# Altium project InductiveSensor_LDC1612.PrjPcb (part 2 of 2)

## Sheet CAN_TxRx.SchDoc
size A; SheetNumber: 5; SheetTotal: 7
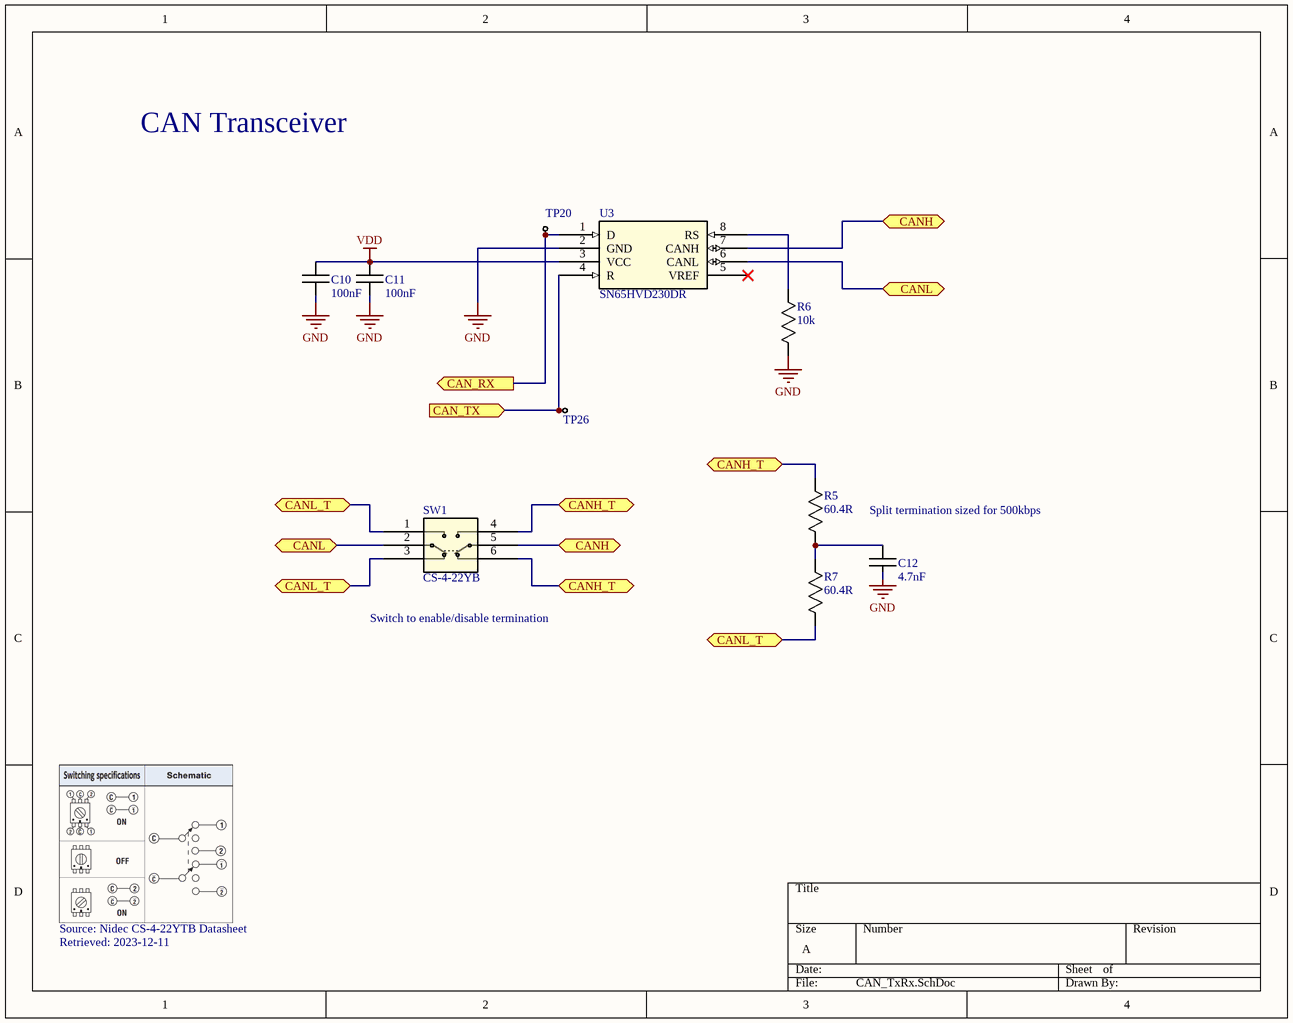
[diagram p4: CAN_TxRx.SchDoc]

### Parts
C10  100nF  [CAP0805]
C11  100nF  [CAP0805]
C12  4.7nF  [C0603]
R5  60.4R  [R0603]
R6  10k  [R0603]
R7  60.4R  [R0603]
SW1  CS-4-22YB  [CS-4-22YB_NDC]
TP20  1mm Test Point  [TP_1MM]  (value not drawn)
TP26  1mm Test Point  [TP_1MM]  (value not drawn)
U3  SN65HVD230DR  [SOIC_8]

### Ports
CAN_RX (out, see Microcontroller_STM32F04[1B]), CAN_TX (in, see Microcontroller_STM32F04[1B]), CANH (bidir, see BoardIF[2B], CAN_TxRx[2C]), CANH (bidir, see BoardIF[2B], CAN_TxRx[3A]), CANH_T (bidir, see CAN_TxRx[2B], CAN_TxRx[2C]), CANH_T (bidir, see CAN_TxRx[2B], CAN_TxRx[3B]), CANH_T (bidir, see CAN_TxRx[2C], CAN_TxRx[3B]), CANL (bidir, see BoardIF[2B], CAN_TxRx[1C]), CANL (bidir, see BoardIF[2B], CAN_TxRx[3B]), CANL_T (bidir, see CAN_TxRx[1B], CAN_TxRx[1C]), CANL_T (bidir, see CAN_TxRx[1B], CAN_TxRx[3C]), CANL_T (bidir, see CAN_TxRx[1C], CAN_TxRx[3C])

### Nets
GND: C10.2 C11.2 C12.2 R6.2 U3.2(GND)
VDD: C10.1 C11.1 U3.3(VCC)
NetC12_1: C12.1 R5.2 R7.1
NetR5_1: R5.1 SW1.4 SW1.6 ; port CANH_T
NetR6_1: R6.1 U3.8(RS)
NetR7_2: R7.2 SW1.1 SW1.3 ; port CANL_T
NetSW1_2: SW1.2 U3.6(CANL) ; port CANL
NetSW1_5: SW1.5 U3.7(CANH) ; port CANH
NetTP20_1: TP20.1 U3.1(D) ; port CAN_RX
NetTP26_1: TP26.1 U3.4(R) ; port CAN_TX

Not connected (* = marked no-connect by the designer): U3 5(VREF)*

### Notes on the sheet
- CAN Transceiver
- Split termination sized for 500kbps
- Switch to enable/disable termination
- Source: Nidec CS-4-22YTB Datasheet
- Retrieved: 2023-12-11

### Library data of the parts
C10 C11 = CC0805KRX7R9BB104: Multilayer Ceramic Capacitor, 0.1 uF, 50 V, ± 10%, X7R, 0805 [2012 Metric]; Manufacturer: Yageo; Value: 100nF 50V; Voltage: 50V; Insulation Resistance: 100GR; Supplier: Digi-Key; Supplier Part Number: 311-1140-1-ND; Manufacturer Part Number: CC0805KRX7R9BB104; RoHS: Yes; Category: Ceramic Capacitors; Stock: 6426664; Pricing: 1=0.1, 10=0.07, 50=0.0418, 100=0.0329, 500=0.02428, 1000=0.0201 (USD); Mounting Technology: Surface Mount; Case/Package: 0805; Pins: 2; Case Code (Metric): 2012; Case Code (Imperial): 0805; Material: Ceramic; Min Operating Temperature: -55°C; Max Operating Temperature: 125°C; Tolerance: 10%; Dielectric: X7R; Packaging: Tape and Reel; Voltage Rating: 50V; Package Quantity: 4000; Termination: SMD/SMT; Series: CC; Length: 2mm; Height: 0.85mm; Depth: 1.25mm; Radiation Hardening: No; RoHS Compliant: Yes; Reach SVHC Compliant: No; Lead Free: Lead Free; Halogen Free: Halogen Free; ComponentLink1URL: https://datasheet.ciiva.com/11786/0900766b80d84f1d-11786009.pdf?src-supplier=Rs; ComponentLink1Description: https://datasheet.ciiva.com/11786/0900766b80d84f1d-11786009.pdf?src-supplier=Rs; ComponentLink2URL: https://datasheet.ciiva.com/46393/1734573-46393307.pdf?src-supplier=Element14; ComponentLink2Description: https://datasheet.ciiva.com/46393/1734573-46393307.pdf?src-supplier=Element14; ComponentLink3URL: https://datasheet.ciiva.com/155/mlccorderingcode-155930.pdf?src-supplier=Digi-Key; ComponentLink3Description: https://datasheet.ciiva.com/155/mlccorderingcode-155930.pdf?src-supplier=Digi-Key; ComponentLink4URL: https://datasheet.ciiva.com/155/mlccorderingcode-155929.pdf?src-supplier=Digi-Key; ComponentLink4Description: https://datasheet.ciiva.com/155/mlccorderingcode-155929.pdf?src-supplier=Digi-Key; ComponentLink5URL: https://datasheet.ciiva.com/155/mlccorderingcode-155931.pdf?src-supplier=Digi-Key; ComponentLink5Description: https://datasheet.ciiva.com/155/mlccorderingcode-155931.pdf?src-supplier=Digi-Key; ComponentLink6URL: https://datasheet.ciiva.com/11464/upy-gphc-x7r-6-3v-to-50v-8-11464757.pdf?src-supplier=Avnet; ComponentLink6Description: https://datasheet.ciiva.com/11464/upy-gphc-x7r-6-3v-to-50v-8-11464757.pdf?src-supplier=Avnet; ComponentLink7URL: https://datasheet.ciiva.com/28450/1489800-28450805.pdf?src-supplier=Element14; ComponentLink7Description: https://datasheet.ciiva.com/28450/1489800-28450805.pdf?src-supplier=Element14; ComponentLink8URL: https://datasheet.ciiva.com/29242/445210-da-01-en-kerko-chip-0805-x7r-0-1uf-10proz-50vg-29242074.pdf?src-supplier=Conrad; ComponentLink8Description: https://datasheet.ciiva.com/29242/445210-da-01-en-kerko-chip-0805-x7r-0-1uf-10proz-50vg-29242074.pdf?src-supplier=Conrad; LCSC Part#: C49678
C12 = C0603C472K1TACAUTO: Cap Cer 0603 4.7NF 100VDC X8G; Manufacturer: KEMET; Supplier: Digi-Key; Supplier Part Number: 399-C0603C472K1TACAUTOCT-ND; Manufacturer Part Number: C0603C472K1TACAUTO; RoHS: No; Category: Ceramic Capacitors; Stock: 10636; Pricing: 1=0.42, 10=0.284, 50=0.2264, 100=0.1869, 500=0.14604, 1000=0.12414 (USD); Value: 4.7nF 100V; LCSC Part#: C3882427; Package: 0603
R5 R7 = RC0603FR-0760R4L: Res Thick Film 0603 60.4 Ohm 1% 0.1W(1/10W) ±100ppm/C Pad SMD T/R; Manufacturer: Yageo; Power Rating: 100mW; Voltage Rating: 50V; Temperature Coefficient: 100ppm/°C; Supplier: Digi-Key; Supplier Part Number: 311-60.4HRCT-ND; Manufacturer Part Number: RC0603FR-0760R4L; RoHS: Yes; Category: Chip SMD Resistors; Stock: 143040; Pricing: 1=0.1, 10=0.019, 50=0.0112, 100=0.0093, 500=0.00622, 1000=0.00532 (USD); Case/Package: 0603; Case Code (Imperial): 0603; Case Code (Metric): 1608; Min Operating Temperature: -55°C; Max Operating Temperature: 155°C; Packaging: Tape and Reel; Value: 60.4R; Tolerance: 1%; Termination: SMD/SMT; Voltage Rating (DC): 50V; Features: Moisture Resistant; Series: RC; Max Power Dissipation: 100mW; Number of Terminations: 2; Length: 1.6mm; Width: 0.8mm; Height: 0.45mm; Lead Free: Lead Free; RoHS Compliant: Yes; ComponentLink1URL: https://datasheet.ciiva.com/12558/rc0603-272842-12558933.pdf?src-supplier=Mouser; ComponentLink1Description: https://datasheet.ciiva.com/12558/rc0603-272842-12558933.pdf?src-supplier=Mouser; LCSC Part#: C245987
R6 = RC0603JR-0710KL: SMD Chip Resistor, 10 kOhm, ± 5%, 100 mW, 0603 [1608 Metric], Thick Film, General Purpose; Manufacturer: Yageo; Value: 10kR; Temperature Coefficient: 100ppm/°C; Max Power Dissipation: 100mW; Voltage Rating (AC): 50V; Supplier: Digi-Key; Supplier Part Number: 311-10KGRCT-ND; Manufacturer Part Number: RC0603JR-0710KL; RoHS: Yes; Category: Chip SMD Resistors; Stock: 3736571; Pricing: 1=0.1, 10=0.015, 50=0.0092, 100=0.0076, 500=0.00512, 1000=0.00437 (USD); Case/Package: 0603; Min Operating Temperature: -55°C; Max Operating Temperature: 155°C; Tolerance: 5%; Number of Terminations: 2; Series: RC; Reach SVHC Compliant: 4187SVHC; RoHS Compliant: Yes; ComponentLink1URL: https://datasheet.ciiva.com/2452/pyu-rc-group-51-rohs-l-10-2452848.pdf?src-supplier=Digi-Key; ComponentLink1Description: https://datasheet.ciiva.com/2452/pyu-rc-group-51-rohs-l-10-2452848.pdf?src-supplier=Digi-Key; LCSC Part#: C99198
SW1 = CS-4-22YTB: Switch Rotary ON OFF ON DPDT 2 Flush Screwdriver Gull Wing 0.1A 16VAC 16VDC 0.5VA T/R; Mfr_Name: Nidec Copal Electronics; Manufacturer: Nidec Copal; Body Material: Epoxy; Number of Positions: 2; Voltage Rating (DC): 16V; Electrical Life: 200Cycles; Washable: Yes; Copyright: Copyright (C) 2023 Ultra Librarian. All rights reserved.; Manufacturer_Part_Number: CS-4-22YB; RefDes: RefDes; Type: DEV; Supplier: Digi-Key; Supplier Part Number: 563-1040-1-ND; Manufacturer Part Number: CS-4-22YTB; RoHS: Yes; Category: DIP Switches; Stock: 6353; Pricing: 1=2.85, 10=2.683, 25=2.4392, 100=2.1139, 250=1.91648 (USD); Mounting Technology: Surface Mount; Contact Material: Copper Alloy; Contact Plating: Gold; Min Operating Temperature: -25°C; Max Operating Temperature: 70°C; Throw Configuration: DPDT; Orientation: Vertical; Packaging: Cut Tape; Termination: Gull Wing; Series: CS-4; Actuator Type: Rotary; Lead Free: Lead Free; RoHS Compliant: Yes; ComponentLink1URL: https://datasheet.ciiva.com/2864/cs-4-2864257.pdf?src-supplier=Digi-Key; ComponentLink1Description: https://datasheet.ciiva.com/2864/cs-4-2864257.pdf?src-supplier=Digi-Key; ComponentLink2URL: https://datasheet.ciiva.com/2864/cs-4-2864258.pdf?src-supplier=Digi-Key; ComponentLink2Description: https://datasheet.ciiva.com/2864/cs-4-2864258.pdf?src-supplier=Digi-Key; ComponentLink3URL: https://datasheet.ciiva.com/2864/cs-4-2864259.pdf?src-supplier=Digi-Key; ComponentLink3Description: https://datasheet.ciiva.com/2864/cs-4-2864259.pdf?src-supplier=Digi-Key; LCSC Part#: C2921707; Value: CS-4-22YTB
TP20 TP26 = TestPoint_1mm
U3 = SN65HVD230DR: EAR99 65HVD230 Cut Tape (CT) CANbus interface driver 3.3V 17mA 72.603129mg 1Mbps; Manufacturer: Texas Instruments; Min Supply Voltage: 3V; Max Supply Voltage: 3.6V; Number of Receivers: 1; Number of I/Os: 2; Slew Rate: 15V/µs; Supplier: Digi-Key; Supplier Part Number: 296-11654-6-ND; Manufacturer Part Number: SN65HVD230DR; RoHS: Yes; Category: Interface ICs; Stock: 82408; Pricing: 1=2.5, 10=2.248, 25=2.1208, 100=1.8071, 250=1.6968, 500=1.4847, 1000=1.23018 (USD); Case/Package: D; Pins: 8; Weight: 0.002561oz; Min Operating Temperature: -40°C; Max Operating Temperature: 85°C; Data Rate: 1Mbps; Packaging: Tape and Reel; Package Quantity: 1; Operating Supply Voltage: 3.3V; Number of Transceivers: 1; Number of Drivers: 1; Series: -; Supply Current: 17mA; Number of Transmit Buffers: 1; Number of Receive Buffers: 1; Termination: SMD/SMT; Length: 4.9mm; Width: 3.91mm; Height: 1.75mm; Thickness: 1.58mm; Radiation Hardening: No; Lead Free: Lead Free; RoHS Compliant: Yes; Reach SVHC Compliant: No; ComponentLink1URL: https://datasheet.ciiva.com/3303/slos346k-3303008.pdf?src-supplier=Avnet; ComponentLink1Description: https://datasheet.ciiva.com/3303/slos346k-3303008.pdf?src-supplier=Avnet; ComponentLink2URL: https://datasheet.ciiva.com/28652/1695240-28652369.pdf?src-supplier=Element14; ComponentLink2Description: https://datasheet.ciiva.com/28652/1695240-28652369.pdf?src-supplier=Element14; ComponentLink3URL: https://datasheet.ciiva.com/4781/sn65hvd230-86923-4781328.pdf?src-supplier=Mouser; ComponentLink3Description: https://datasheet.ciiva.com/4781/sn65hvd230-86923-4781328.pdf?src-supplier=Mouser; ComponentLink4URL: https://datasheet.ciiva.com/27052/1495682-27052294.pdf?src-supplier=Jameco; ComponentLink4Description: https://datasheet.ciiva.com/27052/1495682-27052294.pdf?src-supplier=Jameco; ComponentLink5URL: https://datasheet.ciiva.com/1705/sn65hvd230-1705286.pdf?src-supplier=Digi-Key; ComponentLink5Description: https://datasheet.ciiva.com/1705/sn65hvd230-1705286.pdf?src-supplier=Digi-Key; ComponentLink6URL: https://datasheet.ciiva.com/1705/sn65hvd230-1705287.pdf?src-supplier=Digi-Key; ComponentLink6Description: https://datasheet.ciiva.com/1705/sn65hvd230-1705287.pdf?src-supplier=Digi-Key; ComponentLink7URL: https://datasheet.ciiva.com/1705/sn65hvd230-1705288.pdf?src-supplier=Digi-Key; ComponentLink7Description: https://datasheet.ciiva.com/1705/sn65hvd230-1705288.pdf?src-supplier=Digi-Key; ComponentLink8URL: https://datasheet.ciiva.com/22694/1887486-22694362.pdf?src-supplier=Element14; ComponentLink8Description: https://datasheet.ciiva.com/22694/1887486-22694362.pdf?src-supplier=Element14; ComponentLink9URL: https://datasheet.ciiva.com/15150/getdatasheetpartid-393721-15150028.pdf?src-supplier=Verical; ComponentLink9Description: https://datasheet.ciiva.com/15150/getdatasheetpartid-393721-15150028.pdf?src-supplier=Verical; LCSC Part#: C12084; Value: SN65HVD230DR

## Sheet PowerReg.SchDoc
size A; SheetNumber: 6; SheetTotal: 7
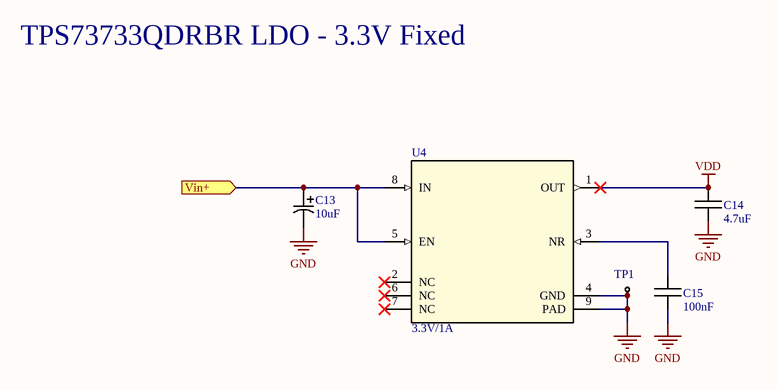
[diagram p5: PowerReg.SchDoc]

### Parts
C13  10uF  [CAP1206_TAJA]
C14  4.7uF  [CAP0805]
C15  100nF  [CAP0805]
TP1  1mm Test Point  [TP_1MM]  (value not drawn)
U4  3.3V/1A  [VSON_DRB8]

### Ports
Vin+ (in, see BoardIF[2B])

### Nets
GND: C13.2 C14.1 C15.2 TP1.1 U4.4(GND) U4.9(PAD)
VDD: C14.2 U4.1(OUT)
NetC13_1: C13.1 U4.5(EN) U4.8(IN) ; port Vin+
NetC15_1: C15.1 U4.3(NR)

Not connected (* = marked no-connect by the designer): U4 2(NC)* 6(NC)* 7(NC)*

### Notes on the sheet
- TPS73733QDRBR LDO - 3.3V Fixed

### Library data of the parts
C13 = TAJA106K016RNJ: Cap Tant Solid 10uF 16V A CASE 10%( 3.2 X 1.6 X 1.6mm) Inward L SMD 3216-18 3 Ohm 125C T/R; Mfr_Name: KYOCERA AVX; Type: DEV; Dielectric Material: Tantalum; Value: 10uF 16V 10% Tantalum; ESR (Equivalent Series Resistance): 3R; Leakage Current: 1.6uA; Dissipation Factor: 8%; Polarity: Polar; Frequency: 300MHz; Life (Hours): 2000Hour; Ripple Current: 158mA; Copyright: Copyright (C) 2023 Ultra Librarian. All rights reserved.; Manufacturer_Part_Number: TAJA106K016RNJ; RefDes: RefDes; Supplier: Digi-Key; Supplier Part Number: 478-1655-6-ND; Manufacturer: Kyocera AVX; Manufacturer Part Number: TAJA106K016RNJ; RoHS: Yes; Category: Tantalum Capacitors; Stock: 8878; Pricing: 1=0.35, 10=0.234, 50=0.1726, 100=0.1405, 500=0.1109, 1000=0.09365 (USD); Mounting Technology: Surface Mount,PCB; Case/Package: 1206; Pins: 2; Case Code (Metric): 3216; Case Code (Imperial): 1206; Min Operating Temperature: -55°C; Max Operating Temperature: 125°C; Tolerance: 10%; Packaging: Tape and Reel; Voltage Rating: 16V; Voltage Rating (DC): 16V; Features: General Purpose; Series: TAJ; Package Quantity: 1; Termination: SMD/SMT; Voltage: 16V; Construction: Flat; Voltage Rating (AC): 16V; Length: 3.2mm; Width: 1.6mm; Height: 1.6mm; Depth: 1.6mm; Height - Seated (Max): 0.071inch; Lead Pitch: 1.1mm; Size: 1.6mm; Radiation Hardening: No; Lead Free: Lead Free; RoHS Compliant: Yes; Reach SVHC Compliant: No; ComponentLink1URL: https://datasheet.ciiva.com/27051/1234933-27051768.pdf?src-supplier=Jameco; ComponentLink1Description: https://datasheet.ciiva.com/27051/1234933-27051768.pdf?src-supplier=Jameco; ComponentLink2URL: https://datasheet.ciiva.com/26341/559411-da-01-en-tacc-a-3-2-mm-x-1-6-mm-x-1-6-mm-10-uf-26341755.pdf?src-supplier=Conrad; ComponentLink2Description: https://datasheet.ciiva.com/26341/559411-da-01-en-tacc-a-3-2-mm-x-1-6-mm-x-1-6-mm-10-uf-26341755.pdf?src-supplier=Conrad; ComponentLink3URL: https://datasheet.ciiva.com/18710/taj-eng-18710622.pdf?src-supplier=Distrelec; ComponentLink3Description: https://datasheet.ciiva.com/18710/taj-eng-18710622.pdf?src-supplier=Distrelec; ComponentLink4URL: https://datasheet.ciiva.com/7730/1703059-7730712.pdf?src-supplier=Element14; ComponentLink4Description: https://datasheet.ciiva.com/7730/1703059-7730712.pdf?src-supplier=Element14; ComponentLink5URL: https://datasheet.ciiva.com/7730/1703059-7730713.pdf?src-supplier=Element14; ComponentLink5Description: https://datasheet.ciiva.com/7730/1703059-7730713.pdf?src-supplier=Element14; ComponentLink6URL: https://datasheet.ciiva.com/7730/taj-7730975.pdf?src-supplier=Element14; ComponentLink6Description: https://datasheet.ciiva.com/7730/taj-7730975.pdf?src-supplier=Element14; ComponentLink7URL: https://datasheet.ciiva.com/7730/1680476-7730714.pdf?src-supplier=Element14; ComponentLink7Description: https://datasheet.ciiva.com/7730/1680476-7730714.pdf?src-supplier=Element14; ComponentLink8URL: https://datasheet.ciiva.com/263/taj-263392.pdf?src-supplier=Digi-Key; ComponentLink8Description: https://datasheet.ciiva.com/263/taj-263392.pdf?src-supplier=Digi-Key; ComponentLink9URL: https://datasheet.ciiva.com/263/taj-263391.pdf?src-supplier=Digi-Key; ComponentLink9Description: https://datasheet.ciiva.com/263/taj-263391.pdf?src-supplier=Digi-Key; ComponentLink10URL: https://datasheet.ciiva.com/263/taj-263393.pdf?src-supplier=Digi-Key; ComponentLink10Description: https://datasheet.ciiva.com/263/taj-263393.pdf?src-supplier=Digi-Key; ComponentLink11URL: https://datasheet.ciiva.com/12882/taj-27497-12882509.pdf?src-supplier=Mouser; ComponentLink11Description: https://datasheet.ciiva.com/12882/taj-27497-12882509.pdf?src-supplier=Mouser; ComponentLink12URL: https://datasheet.ciiva.com/3004/taj-3004388.pdf?src-supplier=Avnet; ComponentLink12Description: https://datasheet.ciiva.com/3004/taj-3004388.pdf?src-supplier=Avnet; ComponentLink13URL: https://datasheet.ciiva.com/16379/taj-16379015.pdf?src-supplier=Future+Electronics; ComponentLink13Description: https://datasheet.ciiva.com/16379/taj-16379015.pdf?src-supplier=Future+Electronics; ComponentLink14URL: https://datasheet.ciiva.com/3004/taj-3004387.pdf?src-supplier=Avnet; ComponentLink14Description: https://datasheet.ciiva.com/3004/taj-3004387.pdf?src-supplier=Avnet; LCSC Part#: C7171
C14 = CL21A475KAQNNNE: Multilayer Ceramic Capacitor, 4.7 uF, 25 V, ± 10%, X5R, 0805 [2012 Metric]; Manufacturer: Samsung; Value: 4.7uF 25V; Voltage Rating: 25V; Supplier: Digi-Key; Supplier Part Number: 1276-1244-1-ND; Manufacturer Part Number: CL21A475KAQNNNE; RoHS: Yes; Category: Ceramic Capacitors; Stock: 3502142; Pricing: 1=0.1, 10=0.069, 50=0.0414, 100=0.0326, 500=0.02408, 1000=0.01994 (USD); Mounting Technology: Surface Mount; Case/Package: 0805; Case Code (Metric): 2012; Case Code (Imperial): 0805; Material: Ceramic; Min Operating Temperature: -55°C; Max Operating Temperature: 85°C; Packaging: Tape and Reel; Tolerance: 10%; Dielectric: X5R; Voltage Rating (DC): 25V; Series: CL; Construction: Flat; Length: 2mm; Height: 1.25mm; Depth: 1.25mm; Radiation Hardening: No; Lead Free: Lead Free; RoHS Compliant: Yes; ComponentLink1URL: https://datasheet.ciiva.com/25798/cl21a475kaqnnne-25798882.pdf?src-supplier=Digi-Key; ComponentLink1Description: https://datasheet.ciiva.com/25798/cl21a475kaqnnne-25798882.pdf?src-supplier=Digi-Key; LCSC Part#: C1779
C15 = CC0805KRX7R9BB104: as C10 on sheet CAN_TxRx; Supplier: Digi-Key; Supplier Part Number: 311-1140-1-ND; Manufacturer Part Number: CC0805KRX7R9BB104; RoHS: Yes; Category: Ceramic Capacitors; Stock: 6426664; Pricing: 1=0.1, 10=0.07, 50=0.0418, 100=0.0329, 500=0.02428, 1000=0.0201 (USD); Mounting Technology: Surface Mount; Case/Package: 0805; Pins: 2; Case Code (Metric): 2012; Case Code (Imperial): 0805; Material: Ceramic; Min Operating Temperature: -55°C; Max Operating Temperature: 125°C; Tolerance: 10%; Dielectric: X7R; Packaging: Tape and Reel; Voltage Rating: 50V; Package Quantity: 4000; Termination: SMD/SMT; Series: CC; Length: 2mm; Height: 0.85mm; Depth: 1.25mm; Radiation Hardening: No; RoHS Compliant: Yes; Reach SVHC Compliant: No; Lead Free: Lead Free; Halogen Free: Halogen Free; ComponentLink1URL: https://datasheet.ciiva.com/11786/0900766b80d84f1d-11786009.pdf?src-supplier=Rs; ComponentLink1Description: https://datasheet.ciiva.com/11786/0900766b80d84f1d-11786009.pdf?src-supplier=Rs; ComponentLink2URL: https://datasheet.ciiva.com/46393/1734573-46393307.pdf?src-supplier=Element14; ComponentLink2Description: https://datasheet.ciiva.com/46393/1734573-46393307.pdf?src-supplier=Element14; ComponentLink3URL: https://datasheet.ciiva.com/155/mlccorderingcode-155930.pdf?src-supplier=Digi-Key; ComponentLink3Description: https://datasheet.ciiva.com/155/mlccorderingcode-155930.pdf?src-supplier=Digi-Key; ComponentLink4URL: https://datasheet.ciiva.com/155/mlccorderingcode-155929.pdf?src-supplier=Digi-Key; ComponentLink4Description: https://datasheet.ciiva.com/155/mlccorderingcode-155929.pdf?src-supplier=Digi-Key; ComponentLink5URL: https://datasheet.ciiva.com/155/mlccorderingcode-155931.pdf?src-supplier=Digi-Key; ComponentLink5Description: https://datasheet.ciiva.com/155/mlccorderingcode-155931.pdf?src-supplier=Digi-Key; ComponentLink6URL: https://datasheet.ciiva.com/11464/upy-gphc-x7r-6-3v-to-50v-8-11464757.pdf?src-supplier=Avnet; ComponentLink6Description: https://datasheet.ciiva.com/11464/upy-gphc-x7r-6-3v-to-50v-8-11464757.pdf?src-supplier=Avnet; ComponentLink7URL: https://datasheet.ciiva.com/28450/1489800-28450805.pdf?src-supplier=Element14; ComponentLink7Description: https://datasheet.ciiva.com/28450/1489800-28450805.pdf?src-supplier=Element14; ComponentLink8URL: https://datasheet.ciiva.com/29242/445210-da-01-en-kerko-chip-0805-x7r-0-1uf-10proz-50vg-29242074.pdf?src-supplier=Conrad; ComponentLink8Description: https://datasheet.ciiva.com/29242/445210-da-01-en-kerko-chip-0805-x7r-0-1uf-10proz-50vg-29242074.pdf?src-supplier=Conrad; LCSC Part#: C49678
TP1 = TestPoint_1mm
U4 = TPS73733QDRBRQ1: Automotive 1-A, ultra-low-dropout voltage regulator with reverse current protection & enable; Manufacturer: Texas Instruments; Max Power Dissipation: 2.5W; Number of Outputs: 1; Output Voltage: 3.3V; Dropout Voltage: 130mV; Output Current: 1A; Max Supply Voltage: 5.5V; Min Input Voltage: 2.2V; Min Current Limit: 1.05A; Polarity: Positive; Accuracy: 3%; Output Voltage Accuracy: 1%; Quiescent Current: 300uA; Output Type: Fixed; Supplier: Digi-Key; Supplier Part Number: 296-24157-1-ND; Manufacturer Part Number: TPS73733QDRBRQ1; RoHS: Yes; Category: Voltage Regulators - Linear; Stock: 24609; Pricing: 1=2.06, 10=1.847, 25=1.7424, 100=1.4844, 250=1.3938, 500=1.21958, 1000=1.0105 (USD); Case/Package: SON; Pins: 8; Min Operating Temperature: -40°C; Max Operating Temperature: 125°C; Packaging: Tape and Reel; Package Quantity: 1; Max Output current: 1A; Number of Regulators: 1; Nominal Output Voltage: 3.3V; Power Dissipation: 2.5W; Min Output Voltage: 3.3V; Max Output Voltage: 3.3V; Series: Automotive, AEC-Q100; Length: 3mm; Width: 3mm; Height: 1mm; Thickness: 880um; Radiation Hardening: No; Reach SVHC Compliant: No; Lead Free: Lead Free; RoHS Compliant: Yes; ComponentLink1URL: https://datasheet.ciiva.com/2045/tps73719-q1-2045686.pdf?src-supplier=Digi-Key; ComponentLink1Description: https://datasheet.ciiva.com/2045/tps73719-q1-2045686.pdf?src-supplier=Digi-Key; ComponentLink2URL: https://datasheet.ciiva.com/3224/tps73733-q1-3224372.pdf?src-supplier=Avnet; ComponentLink2Description: https://datasheet.ciiva.com/3224/tps73733-q1-3224372.pdf?src-supplier=Avnet; ComponentLink3URL: https://datasheet.ciiva.com/4888/sbvs123-125968-4888332.pdf?src-supplier=Mouser; ComponentLink3Description: https://datasheet.ciiva.com/4888/sbvs123-125968-4888332.pdf?src-supplier=Mouser; ComponentLink4URL: https://datasheet.ciiva.com/14277/sbvs123-14277182.pdf?src-supplier=Avnet; ComponentLink4Description: https://datasheet.ciiva.com/14277/sbvs123-14277182.pdf?src-supplier=Avnet; LCSC Part#: C523768; Value: TPS73733QDRBRQ1

## Sheet HumTempSensor.SchDoc
size A; SheetNumber: 7; SheetTotal: 7
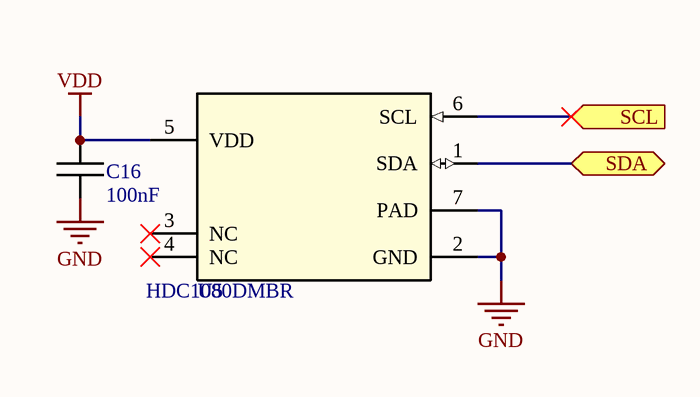
[diagram p6: HumTempSensor.SchDoc]

### Parts
C16  100nF  [CAP0805]
U5  value HDC1080DMBR  [WSON_DMB6]  (hidden comment: I2C Humidity/Temp Sensor)

### Ports
SCL (in, see Microcontroller_STM32F04[1B], Sense_LDC1612[2B]), SDA (bidir, see Microcontroller_STM32F04[1B], Sense_LDC1612[2B])

### Nets
GND: C16.2 U5.2(GND) U5.7(PAD)
VDD: C16.1 U5.5(VDD)
NetR1_2: U5.1(SDA) ; port SDA
NetR2_2: U5.6(SCL) ; port SCL

Not connected (* = marked no-connect by the designer): U5 3(NC)* 4(NC)*

### Library data of the parts
C16 = CC0805KRX7R9BB104: as C10 on sheet CAN_TxRx; Supplier: Digi-Key; Supplier Part Number: 311-1140-1-ND; Manufacturer Part Number: CC0805KRX7R9BB104; RoHS: Yes; Category: Ceramic Capacitors; Stock: 6426664; Pricing: 1=0.1, 10=0.07, 50=0.0418, 100=0.0329, 500=0.02428, 1000=0.0201 (USD); Mounting Technology: Surface Mount; Case/Package: 0805; Pins: 2; Case Code (Metric): 2012; Case Code (Imperial): 0805; Material: Ceramic; Min Operating Temperature: -55°C; Max Operating Temperature: 125°C; Tolerance: 10%; Dielectric: X7R; Packaging: Tape and Reel; Voltage Rating: 50V; Package Quantity: 4000; Termination: SMD/SMT; Series: CC; Length: 2mm; Height: 0.85mm; Depth: 1.25mm; Radiation Hardening: No; RoHS Compliant: Yes; Reach SVHC Compliant: No; Lead Free: Lead Free; Halogen Free: Halogen Free; ComponentLink1URL: https://datasheet.ciiva.com/11786/0900766b80d84f1d-11786009.pdf?src-supplier=Rs; ComponentLink1Description: https://datasheet.ciiva.com/11786/0900766b80d84f1d-11786009.pdf?src-supplier=Rs; ComponentLink2URL: https://datasheet.ciiva.com/46393/1734573-46393307.pdf?src-supplier=Element14; ComponentLink2Description: https://datasheet.ciiva.com/46393/1734573-46393307.pdf?src-supplier=Element14; ComponentLink3URL: https://datasheet.ciiva.com/155/mlccorderingcode-155930.pdf?src-supplier=Digi-Key; ComponentLink3Description: https://datasheet.ciiva.com/155/mlccorderingcode-155930.pdf?src-supplier=Digi-Key; ComponentLink4URL: https://datasheet.ciiva.com/155/mlccorderingcode-155929.pdf?src-supplier=Digi-Key; ComponentLink4Description: https://datasheet.ciiva.com/155/mlccorderingcode-155929.pdf?src-supplier=Digi-Key; ComponentLink5URL: https://datasheet.ciiva.com/155/mlccorderingcode-155931.pdf?src-supplier=Digi-Key; ComponentLink5Description: https://datasheet.ciiva.com/155/mlccorderingcode-155931.pdf?src-supplier=Digi-Key; ComponentLink6URL: https://datasheet.ciiva.com/11464/upy-gphc-x7r-6-3v-to-50v-8-11464757.pdf?src-supplier=Avnet; ComponentLink6Description: https://datasheet.ciiva.com/11464/upy-gphc-x7r-6-3v-to-50v-8-11464757.pdf?src-supplier=Avnet; ComponentLink7URL: https://datasheet.ciiva.com/28450/1489800-28450805.pdf?src-supplier=Element14; ComponentLink7Description: https://datasheet.ciiva.com/28450/1489800-28450805.pdf?src-supplier=Element14; ComponentLink8URL: https://datasheet.ciiva.com/29242/445210-da-01-en-kerko-chip-0805-x7r-0-1uf-10proz-50vg-29242074.pdf?src-supplier=Conrad; ComponentLink8Description: https://datasheet.ciiva.com/29242/445210-da-01-en-kerko-chip-0805-x7r-0-1uf-10proz-50vg-29242074.pdf?src-supplier=Conrad; LCSC Part#: C49678
U5 = HDC1080DMBR: SENSOR HUMI/TEMP 3.3V I2C 4% SMD; Manufacturer: Texas Instruments; Response Time: 15s; Accuracy: 2%; Sensor Type: Temperature; Supplier: Digi-Key; Supplier Part Number: 296-46272-6-ND; Manufacturer Part Number: HDC1080DMBR; RoHS: Yes; Category: Integrated Circuits (ICs); Stock: 8356; Pricing: 1=3.68, 10=2.759, 25=2.4524, 50=2.3296, 100=2.2684, 500=1.90052, 1000=1.7779 (USD); Mounting Technology: Surface Mount; Min Operating Temperature: -40°C; Max Operating Temperature: 125°C; Output Type: I2C; Series: -; Packaging: Cut Tape; Interface: I2C; Lead Free: Lead Free; RoHS Compliant: Yes; ComponentLink1URL: http://www.ti.com/lit/ds/symlink/hdc1080.pdf?src-supplier=Digi-Key; ComponentLink1Description: http://www.ti.com/lit/ds/symlink/hdc1080.pdf?src-supplier=Digi-Key; ComponentLink2URL: http://www.ti.com/general/docs/suppproductinfo.tsp?distId=10&amp;gotoUrl=http%3A%2F%2Fwww.ti.com%2Flit%2Fgpn%2Fhdc1080&src-supplier=Digi-Key; ComponentLink2Description: http://www.ti.com/general/docs/suppproductinfo.tsp?distId=10&amp;gotoUrl=http%3A%2F%2Fwww.ti.com%2Flit%2Fgpn%2Fhdc1080&src-supplier=Digi-Key; LCSC Part#: C82227

## Nets that join several sheets
GND: Sense_LDC1612 (12 pins), Microcontroller_STM32F04 (9 pins), BoardIF (X2.4 X3.4), CAN_TxRx (5 pins), PowerReg (6 pins), HumTempSensor (C16.2 U5.2 U5.7)
VDD: Sense_LDC1612 (8 pins), Microcontroller_STM32F04 (D2.2), CAN_TxRx (C10.1 C11.1 U3.3), PowerReg (C14.2 U4.1), HumTempSensor (C16.1 U5.5)
NetC13_1: BoardIF (X2.1 X3.1), PowerReg (C13.1 U4.5 U4.8)
NetR1_2: Sense_LDC1612 (R1.2 U1.2), Microcontroller_STM32F04 (U2.20), HumTempSensor (U5.1)
NetR2_2: Sense_LDC1612 (R2.2 U1.1), Microcontroller_STM32F04 (U2.19), HumTempSensor (U5.6)
NetSW1_2: BoardIF (X2.3 X3.3), CAN_TxRx (SW1.2 U3.6)
NetSW1_5: BoardIF (X2.2 X3.2), CAN_TxRx (SW1.5 U3.7)
NetTP9_1: Sense_LDC1612 (TP9.1 U1.5), Microcontroller_STM32F04 (U2.10)
NetTP20_1: Microcontroller_STM32F04 (U2.21), CAN_TxRx (TP20.1 U3.1)
NetTP26_1: Microcontroller_STM32F04 (U2.22), CAN_TxRx (TP26.1 U3.4)